# EasyEDA Pro project binary_watch.eprj

# Schematic Schematic1
Board Name: Board1; Create Date: 2025-03-14; Page Name: P1; Project Name: binary_watch; Schematic Name: Schematic1; Update Date: 2025-03-21; Add into BOM: yes; Convert to PCB: yes; Version: 1
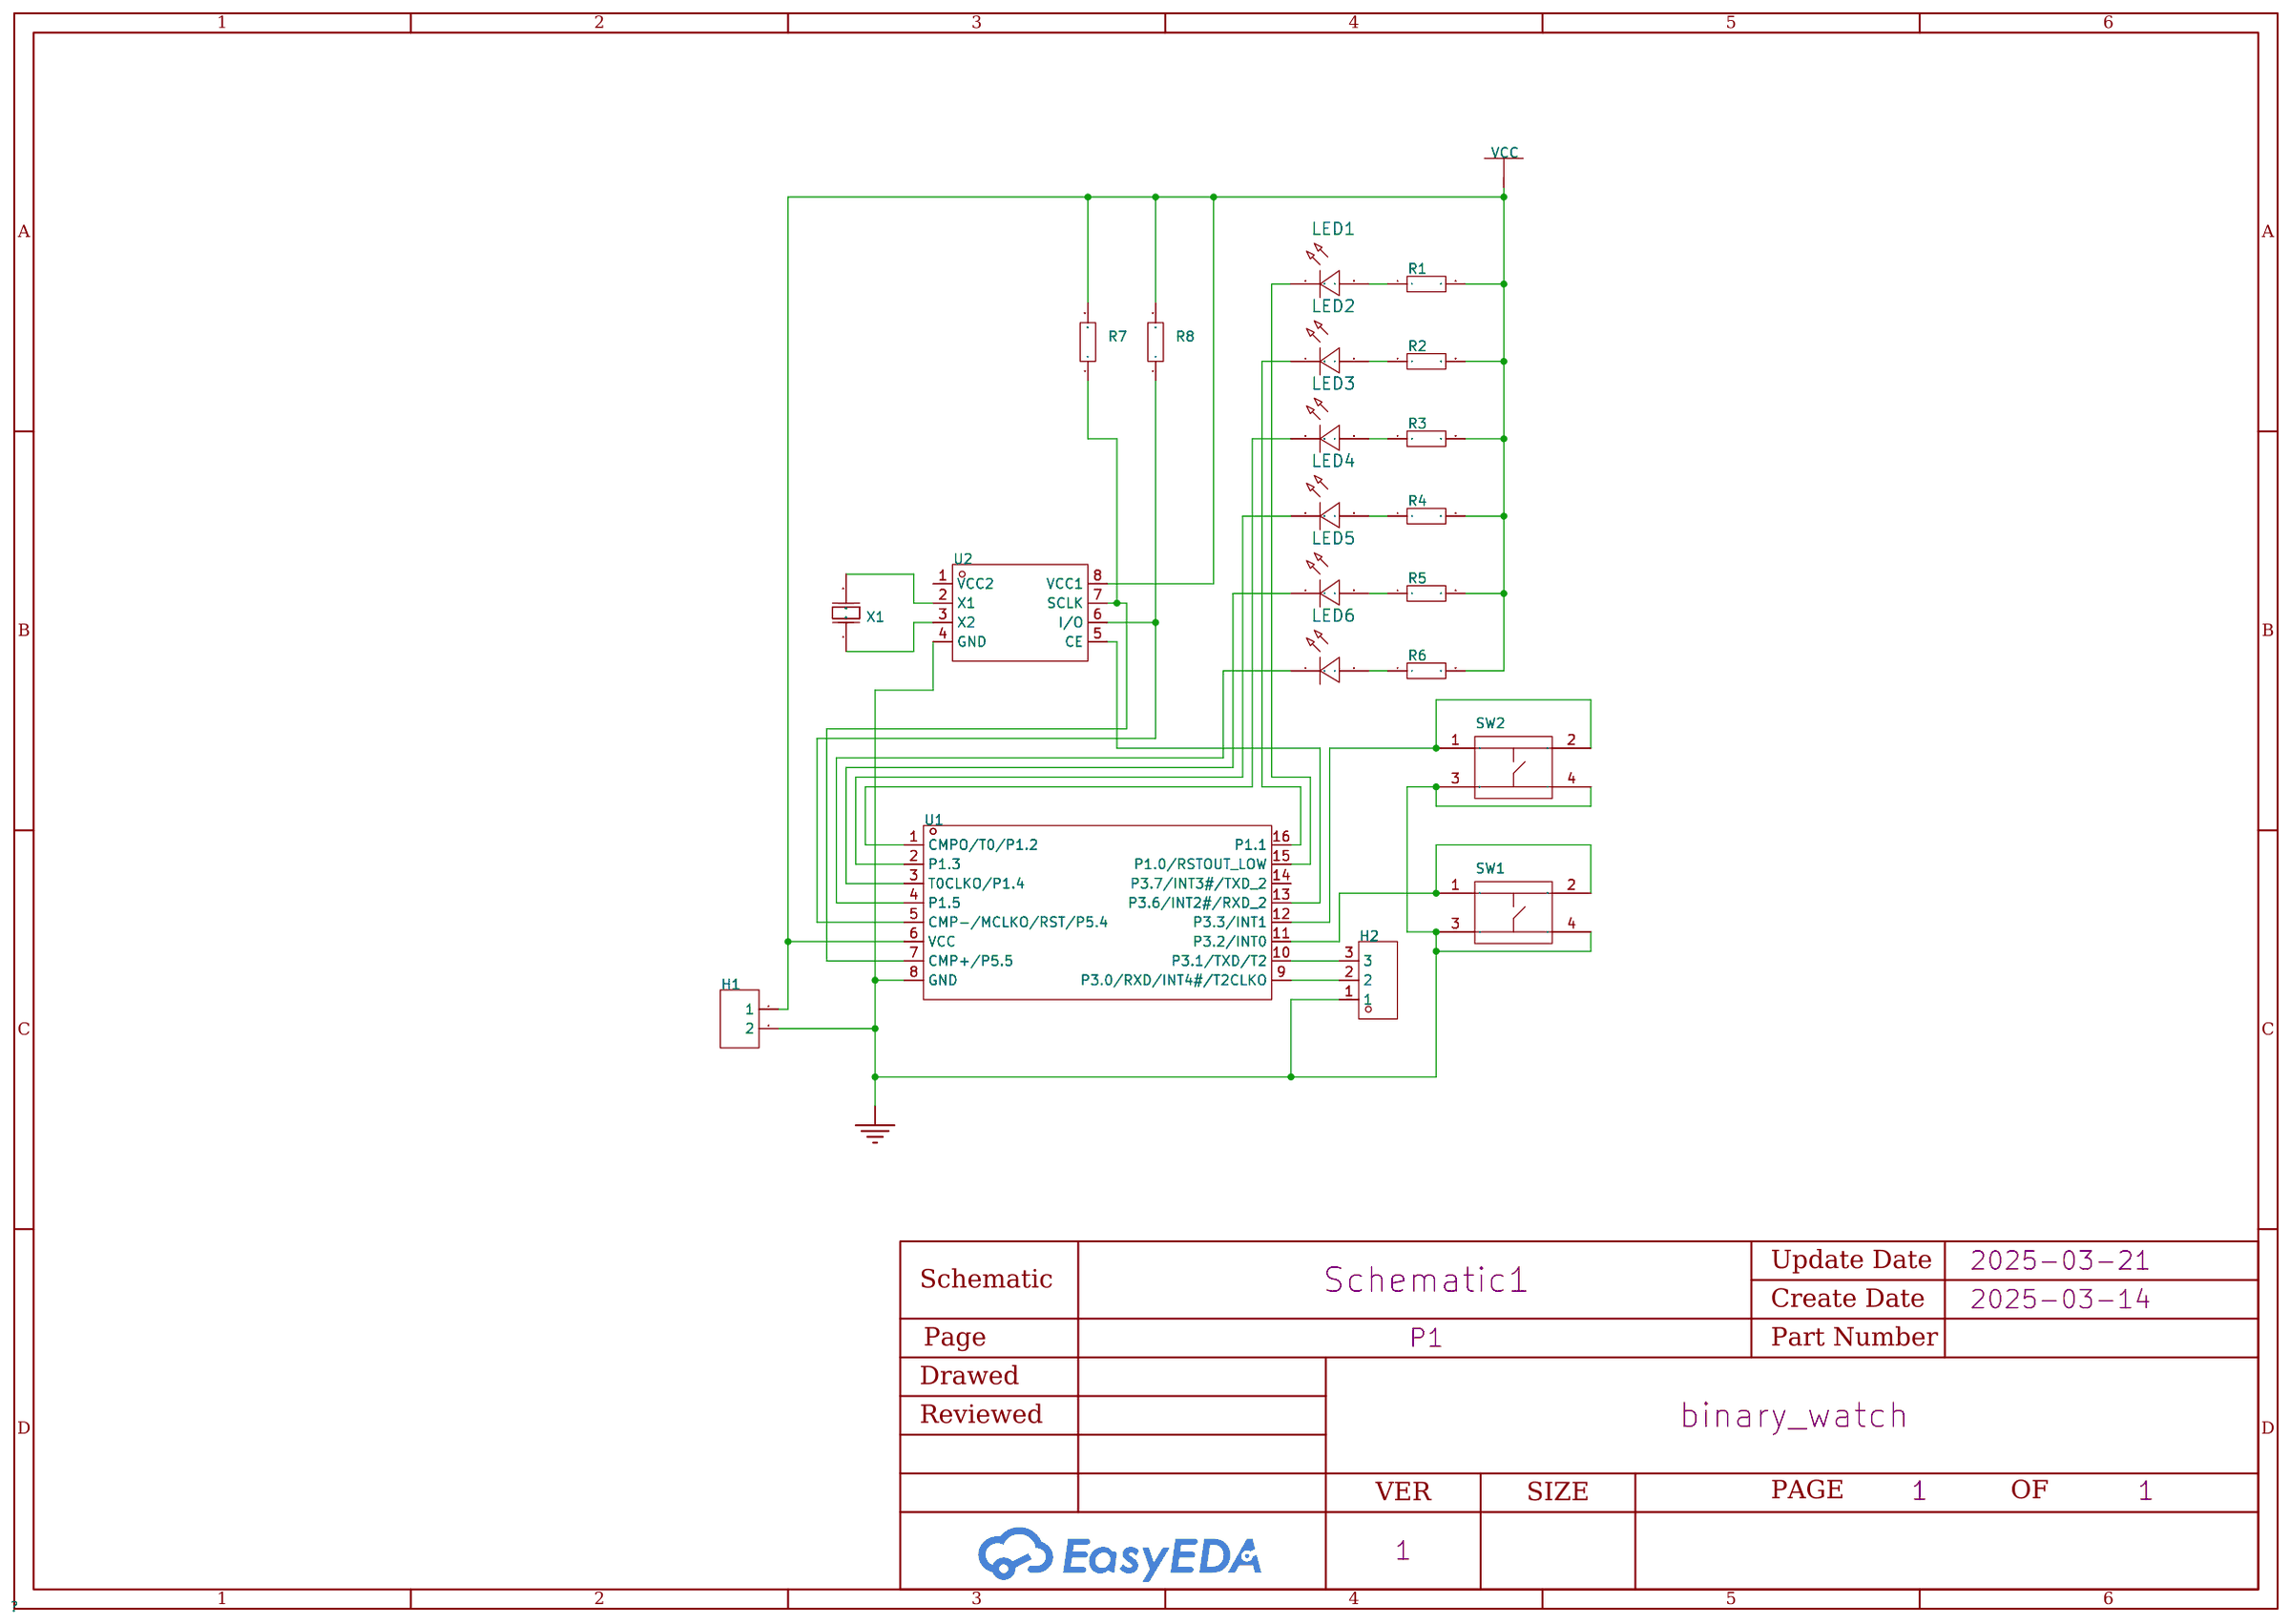
[diagram p0: schematic sheet]

## Parts
H1  -  [HDR-TH_2P-P2.54-V-F]
H2  -  [HDR-TH_3P-P2.54-V-M]
LED1  -  [LED_0805]
LED2  -  [LED_0805]
LED3  -  [LED_0805]
LED4  -  [LED_0805]
LED5  -  [LED_0805]
LED6  -  [LED_0805]
R1  100Ω  [R0805]
R2  100Ω  [R0805]
R3  100Ω  [R0805]
R4  100Ω  [R0805]
R5  100Ω  [R0805]
R6  100Ω  [R0805]
R7  100Ω  [R0805]
R8  100Ω  [R0805]
SW1  -  [KEY-SMD_4P-L5.2-W5.2-P3.70-LS6.4]
SW2  -  [KEY-SMD_4P-L5.2-W5.2-P3.70-LS6.4]
U1  -  [SOP-16_L10.0-W3.9-P1.27-LS6.0-BL]
U2  -  [SOIC-8_L4.9-W3.9-P1.27-LS6.0-BL]
X1  32.768kHz  [OSC-TH_BD2.0-P0.70-D0.3]

## Library data of the parts
H1 = HDR-F_2.54_1x2P: Supplier Part: C49661; Supplier Footprint: 插件; Holes Structure: 1x2P; Pitch: 2.54mm; Mounting Type: Straight; Number of Rows: Plugin; Number of Holes: 2P
H2 = HDR-M_2.54_1x3P: Supplier Part: C2937625; Supplier Footprint: 插件; Pin Structure: 1x3P; Pitch: 2.54mm; Circluar Pins/Square Pins: Square Pins; Mounting Type: Straight; Number of Rows: Plugin; Number of Pins: 3P; Current Rating (Max): 3A; Voltage Rating (Max): 250V; Length of Mating Pin: 6mm; Insulation Height: 2.5mm; Length of End Connection Pin: 3mm; Operating Temperature Range: -40℃~+105℃; Color: Black
LED1-LED6 = LED_0805-R: Supplier Footprint: 0805
R1-R8 = RS-05K1000FT: LCSC Part Name: 100Ω(1000) ±1%; Supplier Part: C115424; Manufacturer: FH(风华); Supplier Footprint: 0805; JLCPCB Part Class: Extended Part; Datasheet: https://atta.szlcsc.com/upload/public/pdf/source/20170704/1499151318885.pdf; Supplier: LCSC
SW1 SW2 = K2-1102DP-C4SW-04: LCSC Part Name: 轻触按键开关6*6*5; Supplier Part: C110153; Manufacturer: 韩国韩荣; Supplier Footprint: 插件; JLCPCB Part Class: Extended Part; Datasheet: https://atta.szlcsc.com/upload/public/pdf/source/20210810/D0CD9D77408EACA829A5E533AC6E5B1E.pdf; Supplier: LCSC; Contact Current: 50mA; Voltage Rating (DC): 12V; Insulation Resistance: 100MΩ; Circuit: SPST; Mounting Style: Straight; Actuator Style: Round Button; Operating Force: 250gf@±30gf; Mechanical Life: 100000; Operating Temperature: -25℃~+85℃; Switch Length: 6mm; Switch Width: 6mm; Switch Height: 5mm
U1 = STC15W204S-35I-SOP16: Supplier Part: C21220; Supplier Footprint: SOP-16_150mil; JLCPCB Part Class: Extended Part; Datasheet: https://atta.szlcsc.com/upload/public/pdf/source/20140225/1457706979554.pdf; Supplier: LCSC
U2 = DS1302Z+T&R: Supplier Part: C8959; Manufacturer: MAXIM(美信); Supplier Footprint: SOIC-8_150mil; JLCPCB Part Class: Basic Part; Datasheet: https://atta.szlcsc.com/upload/public/pdf/source/20120901/1457706533203.pdf; Supplier: LCSC
X1 = DT-26-32.768K 6pF 20PPM: LCSC Part Name: 32.768KHz 6pF 20PPM; Supplier Part: C127496; Manufacturer: KDS大真空; Supplier Footprint: Through Hole; JLCPCB Part Class: Extended Part; Datasheet: https://atta.szlcsc.com/upload/public/pdf/source/20180530/C127496_773B7E848FE6A3B15D5B9A1A39D6BD8D.pdf; Supplier: LCSC; Crystal Type: Cylinder Crystals; Frequency Tolerance: ±20ppm; Load Capacitance: 6pF

## Nets
GND: H1.2 H2.1 SW1.3 SW1.4 SW2.3 SW2.4 U1.8(GND) U2.4(GND)
VCC: H1.1 R1.2 R2.2 R3.2 R4.2 R5.2 R6.2 R7.2 R8.2 U1.6(VCC) U2.8(VCC1)
$1N2104: SW1.1 SW1.2 U1.11(P3.2/INT0)
$1N2127: SW2.1 SW2.2 U1.12(P3.3/INT1)
$1N2940: R7.1 U1.7(CMP+/P5.5) U2.7(SCLK)
$1N2947: R8.1 U1.5(CMP-/MCLKO/RST/P5.4) U2.6(I/O)
$1N3004: U1.13(P3.6/INT2#/RXD_2) U2.5(CE)
$1N3775: U2.2(X1) X1.2(OSC2)
$1N3781: U2.3(X2) X1.1(OSC1)
$1N4353: H2.3 U1.10(P3.1/TXD/T2)
$1N4357: H2.2 U1.9(P3.0/RXD/INT4#/T2CLKO)
Net-(LED1-1): LED1.1(C) U1.15(P1.0/RSTOUT_LOW)
Net-(LED1-2): LED1.2(A) R1.1
Net-(LED2-1): LED2.1(C) U1.16(P1.1)
Net-(LED2-2): LED2.2(A) R2.1
Net-(LED3-1): LED3.1(C) U1.1(CMPO/T0/P1.2)
Net-(LED3-2): LED3.2(A) R3.1
Net-(LED4-1): LED4.1(C) U1.2(P1.3)
Net-(LED4-2): LED4.2(A) R4.1
Net-(LED5-1): LED5.1(C) U1.3(T0CLKO/P1.4)
Net-(LED5-2): LED5.2(A) R5.1
Net-(LED6-1): LED6.1(C) U1.4(P1.5)
Net-(LED6-2): LED6.2(A) R6.1

Not connected (* = marked no-connect by the designer): U1 14(P3.7/INT3#/TXD_2); U2 1(VCC2)

# Board PCB1
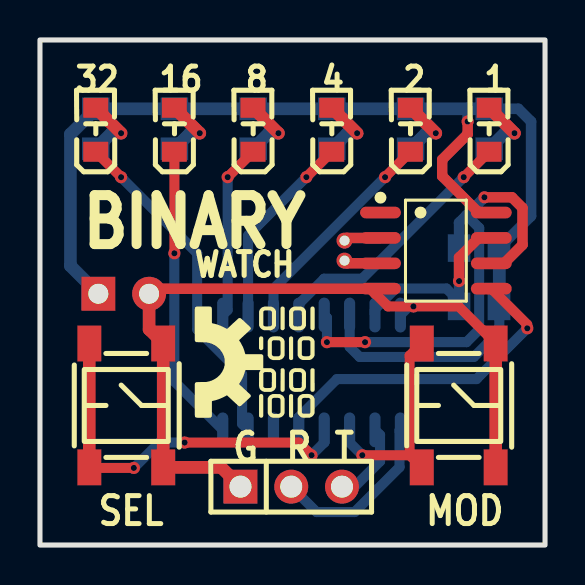
[diagram p1: board, top side]
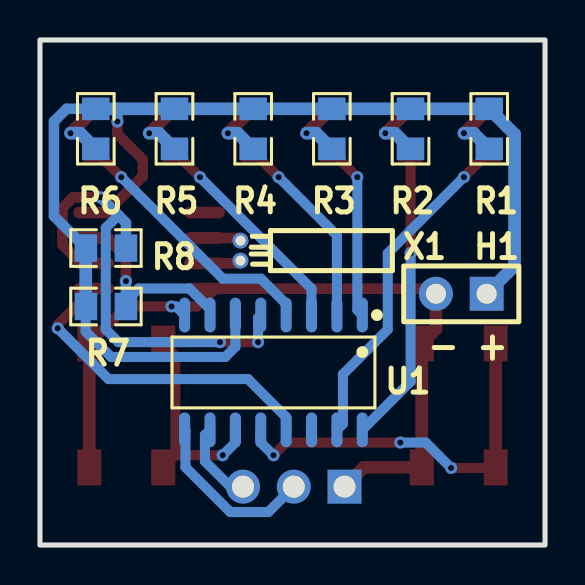
[diagram p2: board, bottom side, seen from below]

Outline 25.27 x 25.27 mm; copper layers: Top Layer, Bottom Layer. Coordinates in mm from the lower left corner of the outline.
Outline path: rectangle 0,25.27 25.27,0
Stack: Top Layer 0.035mm / Dielectric1 1.51mm FR4 er 4.5 / Bottom Layer 0.035mm

## Design rules (mm)
template: Custom Config
spacing copperThickness1oz (default): track to track 0.102, other pairs 0.152 to 0.3
spacing copperThickness2oz: track to track 0.203, other pairs 0.152 to 0.3
track width copperThickness1oz (default): min 0.127, default 0.635, max 2.54
track width copperThickness2oz: min 0.203, default 0.254, max 2.54
differential pair differentialPair (default): width min 0.127, default 0.254, max 2.54; gap min 0.152, default 0.152
via viaSize (default): diameter min 0.5, default 0.61, max 10; hole min 0.3, default 0.305, max 6.3

## Placement (name value [footprint] x y rotation side)
1  -  [LED_0805]  22.48 20.83 90 top
2  -  [LED_0805]  18.54 20.83 90 top
4  -  [LED_0805]  14.6 20.83 90 top
8  -  [LED_0805]  10.67 20.83 90 top
16  -  [LED_0805]  6.73 20.83 90 top
32  -  [LED_0805]  2.79 20.83 90 top
H1  -  [HDR-TH_2P-P2.54-V-F]  4.19 12.57 0 bottom
H2  -  [HDR-TH_3P-P2.54-V-M]  12.57 2.92 0 top
R1  100Ω  [R0805]  2.79 20.83 90 bottom
R2  100Ω  [R0805]  6.73 20.83 90 bottom
R3  100Ω  [R0805]  10.67 20.83 90 bottom
R4  100Ω  [R0805]  14.6 20.83 90 bottom
R5  100Ω  [R0805]  18.54 20.83 90 bottom
R6  100Ω  [R0805]  22.48 20.83 90 bottom
R7  100Ω  [R0805]  21.97 11.94 0 bottom
R8  100Ω  [R0805]  21.97 14.86 0 bottom
SW1  -  [KEY-SMD_4P-L5.2-W5.2-P3.70-LS6.4]  20.96 6.98 90 top
SW2  -  [KEY-SMD_4P-L5.2-W5.2-P3.70-LS6.4]  4.32 6.98 90 top
U1  -  [SOP-16_L10.0-W3.9-P1.27-LS6.0-BL]  13.59 8.64 0 bottom
U2  -  [SOIC-8_L4.9-W3.9-P1.27-LS6.0-BL]  19.81 14.73 270 top
X1  32.768kHz  [OSC-TH_BD2.0-P0.70-D0.3]  15.24 14.73 0 bottom

## Footprints (pads in the part's own frame, mm; a bottom-side part is the same pattern mirrored in y, then rotated)
HDR-TH_2P-P2.54-V-F
  rect 1.7x1.7 hole 1: 1(-1.27,0)
  round 1.7 hole 1: 2(1.27,0)
HDR-TH_3P-P2.54-V-M
  rect 1.7x1.7 hole 1.1: 1(-2.54,0)
  round 1.7 hole 1.1: 2(0,0) 3(2.54,0)
KEY-SMD_4P-L5.2-W5.2-P3.70-LS6.4
  rect 1.801x1.199 smd: 1(-3.099,1.849) 2(3.102,1.849) 3(-3.099,-1.849) 4(3.102,-1.849)
LED_0805
  rect 1x1.25 smd: 1(-1.15,0.005) 2(1.05,0.005)
OSC-TH_BD2.0-P0.70-D0.3
  round 0.8 hole 0.5: 1(0,0.5) 2(0,-0.5)
R0805
  rect 1.133x1.377 smd: 1(-1,0) 2(1,0)
SOIC-8_L4.9-W3.9-P1.27-LS6.0-BL
  oval 0.588x2.045 smd: 1(-1.905,-2.772) 2(-0.635,-2.772) 3(0.635,-2.772) 4(1.905,-2.772) 5(1.905,2.772) 6(0.635,2.772) 7(-0.635,2.772) 8(-1.905,2.772)
SOP-16_L10.0-W3.9-P1.27-LS6.0-BL
  oval 0.56x1.745 smd: 1(-4.445,-2.873) 2(-3.175,-2.873) 3(-1.905,-2.873) 4(-0.635,-2.873) 5(0.635,-2.873) 6(1.905,-2.873) 7(3.175,-2.873) 8(4.445,-2.873) 9(4.445,2.873) 10(3.175,2.873) 11(1.905,2.873) 12(0.635,2.873) 13(-0.635,2.873) 14(-1.905,2.873) 15(-3.175,2.873) 16(-4.445,2.873)

## Nets
GND: H1.2 H2.1 SW1.3 SW1.4 SW2.3 SW2.4 U1.8 U2.4
VCC: H1.1 R1.2 R2.2 R3.2 R4.2 R5.2 R6.2 R7.2 R8.2 U1.6 U2.8
$1N2104: SW1.1 SW1.2 U1.11
$1N2127: SW2.1 SW2.2 U1.12
$1N2245: 1.2 R6.1
$1N2249: 2.2 R5.1
$1N2257: 4.2 R4.1
$1N2262: 8.2 R3.1
$1N2267: 16.2 R2.1
$1N2272: 32.2 R1.1
$1N2367: 32.1 U1.15
$1N2376: 16.1 U1.16
$1N2402: 8.1 U1.1
$1N2418: 4.1 U1.2
$1N2426: 2.1 U1.3
$1N2434: 1.1 U1.4
$1N2940: R7.1 U1.7 U2.7
$1N2947: R8.1 U1.5 U2.6
$1N3004: U1.13 U2.5
$1N3775: U2.2 X1.2
$1N3781: U2.3 X1.1
$1N4353: H2.3 U1.10
$1N4357: H2.2 U1.9

Pads without a net: U1 14; U2 1

## Via types
v1: diameter 0.61, hole 0.305, Top Layer to Bottom Layer, 23 vias

## Routing (per net, layer and track width the routed paths; a pad name or vN(x,y) marks a point on that pad's centre or on a via; arc(x,y) is an arc through that point)
GND: length 39.2
  Top Layer w0.504: SW1.4 20.95,11.94 v1(18.69,11.94) 17.42,11.94 16.79,12.57
  Top Layer w0.529: H1.2 5.72,12.83 16.53,12.83 16.79,12.57 U2.4
  Top Layer w0.635: SW1.4 SW1.3 ; H1.2 5.46,10.79 SW2.4 SW2.3 9.07,3.89 10.03,2.92
  Bottom Layer w0.504: U1.8 18.46,11.94 v1(18.69,11.94)
VCC: length 60.5
  Top Layer w0.529: U2.8 21.95,16.64 20.13,18.46 20.13,19.29 21.4,20.56 v1(21.4,21.19)
  Bottom Layer w0.504: U1.6 15.49,9.92 16,9.41 21.71,9.41 22.98,10.68 22.98,11.95
  Bottom Layer w0.529: 21.4,21.83 v1(21.4,21.19) ; R8.2 24.57,16.46 24.57,21.19 23.94,21.83 R6.2
  Bottom Layer w0.635: R6.2 R5.2 R4.2 R3.2 R2.2 R1.2 1.52,20.56 1.52,13.97 H1.1 ; 22.98,14.87 22.98,11.95 R7.2
$1N2104: length 10.6
  Top Layer w0.504: SW1.2 18.5,9.48 18.5,4.49 ; v1(16.13,4.49) 18.5,4.49 ; 18.5,4.49 SW1.1
  Bottom Layer w0.504: U1.11 15.49,5.13 v1(16.13,4.49)
$1N2127: length 19.7
  Top Layer w0.504: 2.47,3.89 2.5,3.86 v1(4.7,3.86) ; v1(7.24,5.13) 12.95,5.13 v1(13.59,4.49)
  Top Layer w0.635: 2.47,3.89 2.47,10.09
  Bottom Layer w0.504: v1(13.59,4.49) 14.22,5.13 U1.12 ; v1(4.7,3.86) 5.97,5.13 v1(7.24,5.13)
$1N2245: length 3.4
  Top Layer w0.635: 1.2 v1(23.74,20.61)
  Bottom Layer w0.635: R6.1 23.26,20.61 v1(23.74,20.61)
$1N2249: length 3.4
  Top Layer w0.635: 2.2 v1(19.81,20.61)
  Bottom Layer w0.635: v1(19.81,20.61) 19.32,20.61 R5.1
$1N2257: length 3.4
  Top Layer w0.635: 4.2 v1(15.87,20.61)
  Bottom Layer w0.635: v1(15.87,20.61) 15.38,20.61 R4.1
$1N2262: length 3.4
  Top Layer w0.635: 8.2 v1(11.93,20.61)
  Bottom Layer w0.635: R3.1 11.45,20.61 v1(11.93,20.61)
$1N2267: length 3.4
  Top Layer w0.635: 16.2 v1(8,20.61)
  Bottom Layer w0.635: R2.1 7.51,20.61 v1(8,20.61)
$1N2272: length 3.4
  Top Layer w0.635: 2.79,21.88 v1(4.06,20.61)
  Bottom Layer w0.635: R1.1 3.57,20.61 v1(4.06,20.61)
$1N2367: length 17.1
  Top Layer w0.504: 2.79,19.68 v1(4.06,18.41)
  Bottom Layer w0.504: v1(4.06,18.41) 7.87,14.6 7.87,10.79 10.11,8.54 10.11,6.06 U1.15
$1N2376: length 14.9
  Top Layer w0.504: 16.1 v1(6.73,14.6)
  Bottom Layer w0.504: v1(6.73,14.6) 6.73,8.18 U1.16
$1N2402: length 8.8
  Top Layer w0.504: 8.1 v1(9.39,18.41)
  Bottom Layer w0.504: U1.1 9.39,11.76 v1(9.39,18.41)
$1N2418: length 9.9
  Top Layer w0.504: 4.1 v1(13.33,18.41)
  Bottom Layer w0.504: U1.2 10.41,15.49 v1(13.33,18.41)
$1N2426: length 11
  Top Layer w0.504: 2.1 v1(17.27,18.41)
  Bottom Layer w0.504: U1.3 11.68,12.83 v1(17.27,18.41)
$1N2434: length 13.2
  Top Layer w0.504: 1.1 v1(21.2,18.41)
  Bottom Layer w0.504: v1(21.2,18.41) 16.12,13.33 14.22,13.33 12.95,12.06 U1.4
$1N2940: length 9.7
  Top Layer w0.529: v1(20.97,13.21) 20.97,14.39 21.95,15.37 U2.7
  Bottom Layer w0.504: U1.7 16.76,11.81 17.8,12.84 20.34,12.84 20.97,12.2
  Bottom Layer w0.529: v1(20.97,13.21) R7.1
$1N2947: length 24.3
  Top Layer w0.504: v1(16.26,10.15) v1(14.36,10.15)
  Top Layer w0.529: U2.6 23.22,14.1 24.15,15.02 24.15,16.87 23.62,17.4 v1(22.24,17.4)
  Bottom Layer w0.504: v1(14.36,10.15) 14.36,11.37 U1.5 ; v1(16.26,10.15) 21.34,10.15 21.98,10.79 21.98,15.87 21.34,16.5
  Bottom Layer w0.529: R8.1 20.97,16.13 v1(22.24,17.4)
$1N3004: length 16.6
  Top Layer w0.504: U2.5 24.38,11.03 v1(24.38,10.84)
  Bottom Layer w0.504: v1(24.38,10.84) 21.84,8.3 14.86,8.3 12.95,6.4 U1.13
$1N3775: length 1.9
  Top Layer w0.529: U2.2 15.37,15.37 X1.2
$1N3781: length 1.9
  Top Layer w0.529: U2.3 15.37,14.1 X1.1
$1N4353: length 4.1
  Bottom Layer w0.504: H2.3 15.75,2.92 17.02,4.19 17.02,5.51 U1.10
$1N4357: length 8.8
  Bottom Layer w0.504: H2.2 13.84,1.65 15.75,1.65 17.99,3.9 17.99,5.72 U1.9

## Text on the board
Bottom Silkscreen Layer: + | -
Top Silkscreen Layer: WATCH | SEL | G | R | T | MOD | BINARY
